# EAGLE design LME49830_Breakout (EAGLE 6.5.0)
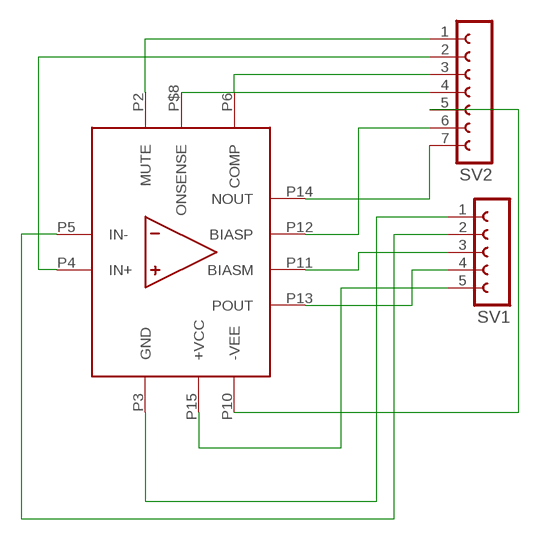
[diagram p0: schematic, sheet 1]

## Parts
SV1  FE05-1  [FE05-1]
SV2  FE07-1  [FE07]
U$1  LME49830  [NDN0015A]

## Nets
N$1: SV1.1 U$1.P3(GND)
N$2: SV1.2 U$1.P5(IN-)
N$3: SV1.3 U$1.P11(BIASM)
N$4: SV1.4 U$1.P13(POUT)
N$5: SV1.5 U$1.P15(+VCC)
N$6: SV2.1 U$1.P2(MUTE)
N$7: SV2.2 U$1.P4(IN+)
N$8: SV2.3 U$1.P6(COMP)
N$9: SV2.4 U$1.P$8(ONSENSE)
N$10: SV2.5 U$1.P10(-VEE)
N$11: SV2.6 U$1.P12(BIASP)
N$12: SV2.7 U$1.P14(NOUT)

## Library data of the parts
SV1 = con-lsta:FE05-1: FEMALE HEADER; OC_FARNELL: unknown; OC_NEWARK: unknown
SV2 = con-lsta:FE07-1: FEMALE HEADER; OC_FARNELL: unknown; OC_NEWARK: unknown
U$1 = LME49830:LME49830: Mono High Fidelity 200 Volt MOSFET Power Amplifier Input Stage with Mute Datasheet: http://www.ti.com/lit/ds/symlink/lme49830.pdf

## Board
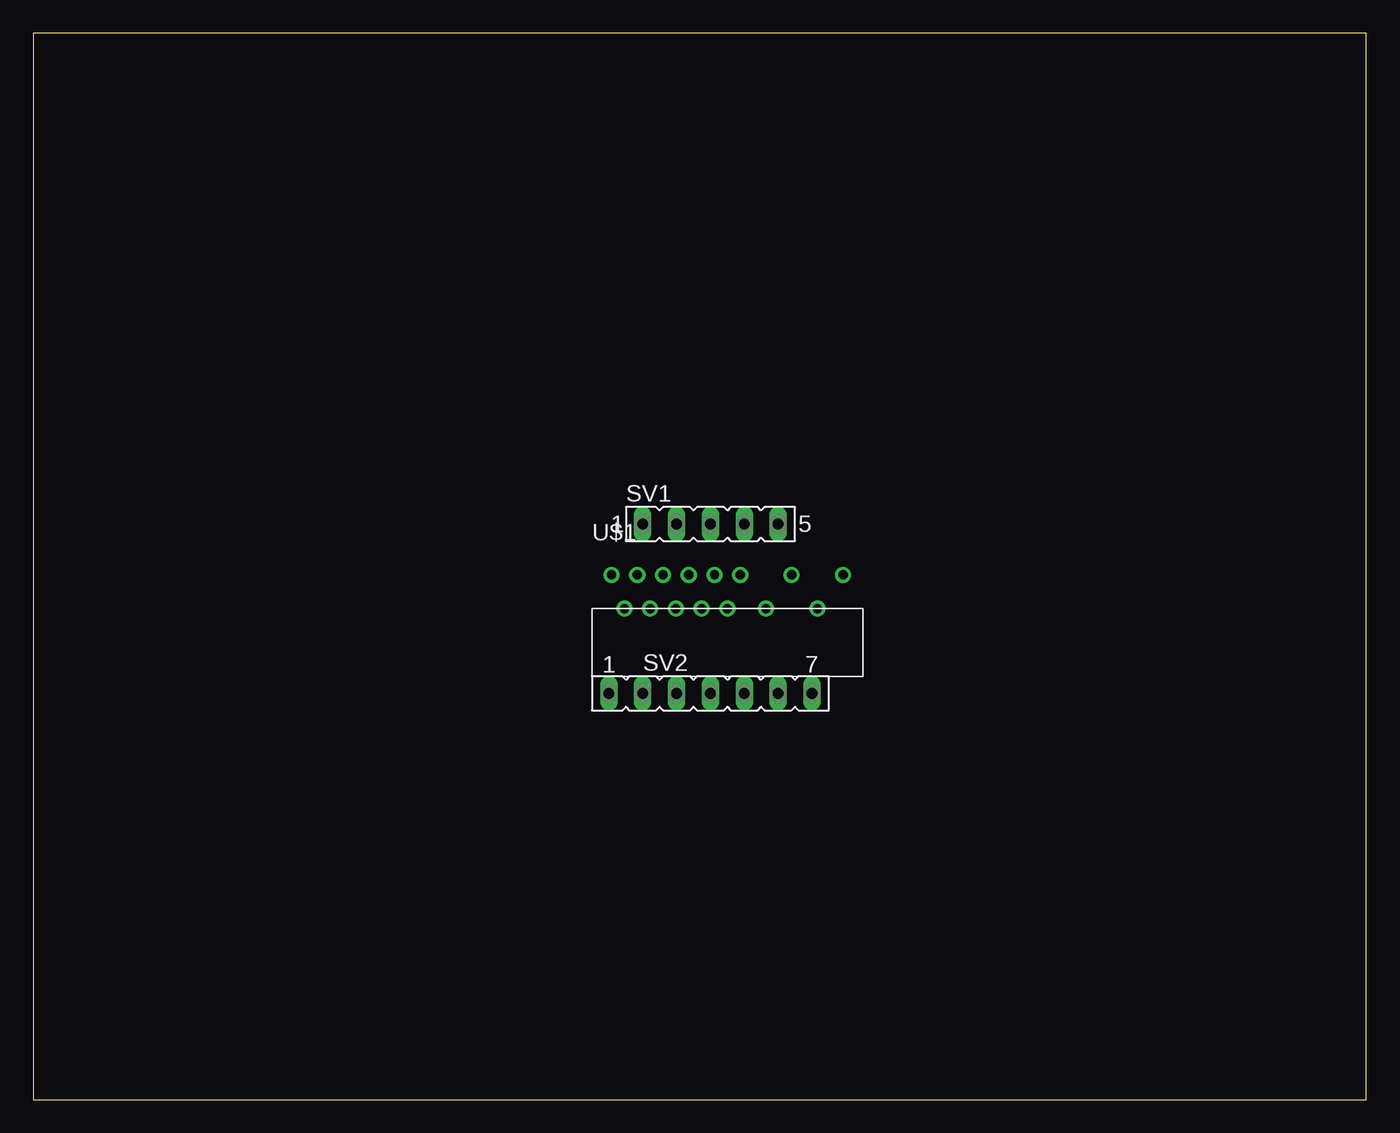
[diagram p1: board, top side]
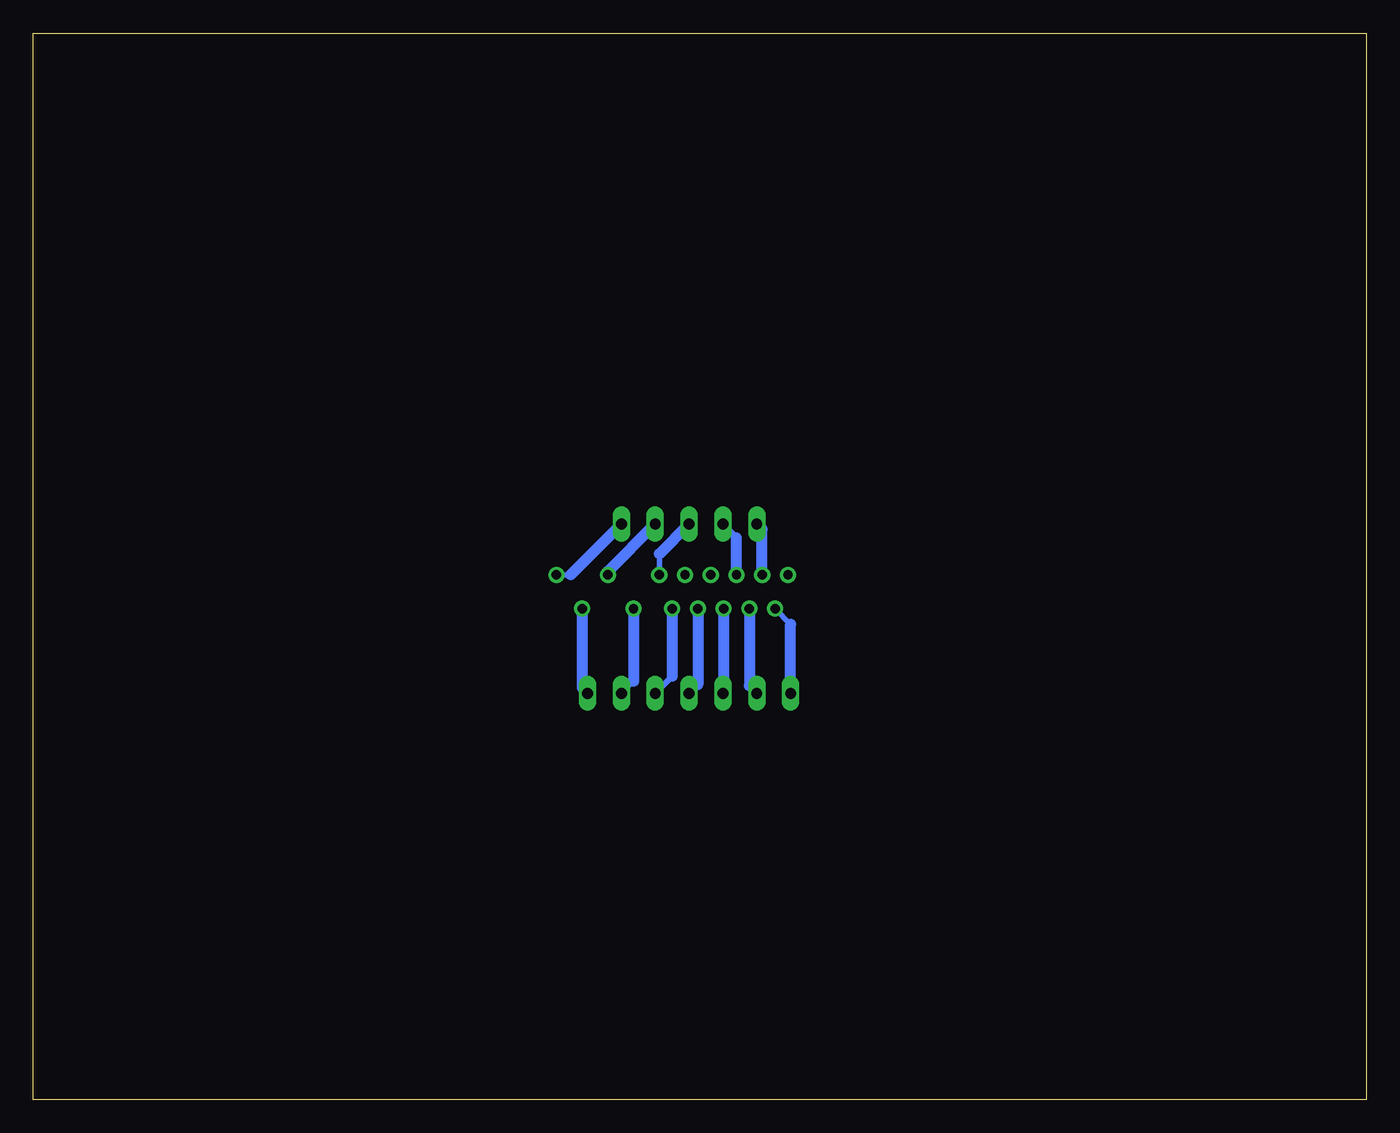
[diagram p2: board, bottom side, seen from below]

Size 100 x 80 mm. Coordinates in mm from the lower left corner, seen from the top.
Outline: 0,0 100,0 100,80 0,80 0,0
Copper layers (1*16): Top 0.035mm / dielectric 1.5mm / Bottom 0.035mm
Design rules "default": minimum track width 10mil, minimum drill 24mil, track to track 8mil, track to pad 8mil, pad to pad 8mil, via to via 8mil, smd to smd 8mil, copper to edge 40mil, drill to drill 8mil, minimum pad ring 10mil, minimum via ring 8mil, stop-mask expansion 4mil, vias tented up to drill 0mil, thermal gap 10mil

### Footprints (pad centres in the part's own frame; a part is rotated, then mirrored left to right if it is on the bottom)
FE05-1 = drill 0.813 long: 1 -5.08,0; 2 -2.54,0; 3 0,0; 4 2.54,0; 5 5.08,0
FE07 = drill 0.813 long: 1 -7.62,0; 2 -5.08,0; 3 -2.54,0; 4 0,0; 5 2.54,0; 6 5.08,0; 7 7.62,0
NDN0015A = drill 0.7: P1 -8.685,2.54; P2 -7.72,0; P3 -6.755,2.54; P4 -5.79,0; P5 -4.825,2.54; P6 -3.86,0; P7 -2.895,2.54; P9 -0.965,2.54; P10 0,0; P11 0.965,2.54; P12 2.895,0; P13 4.825,2.54; P14 6.755,0; P15 8.685,2.54; P$8 -1.93,0

### Placement (x,y rotation side)
SV1  50.8,43.18 0 top
SV2  50.8,30.48 0 top
U$1  52.07,36.83 0 top

### Tracks (layer width: path | path; a pad name or v marks a point on that pad's centre or on a via)
N$1
  Bottom 0.406: 45.31,42.77 SV1.1
  Bottom 0.813: U$1.P3 45.31,42.77
N$2
  Bottom 0.406: 47.24,42.16 SV1.2
  Bottom 0.813: U$1.P5 47.24,42.16
N$3
  Bottom 0.406: U$1.P11 53.03,40.95
  Bottom 0.813: 53.03,40.95 SV1.3
N$4
  Bottom 0.406: U$1.P13 56.9,39.62
  Bottom 0.813: 56.9,39.62 SV1.4
N$5
  Bottom 0.406: U$1.P15 59.69,39.37
  Bottom 0.813: 59.69,39.37 SV1.5
N$6
  Bottom 0.406: 43.18,35.66 U$1.P2
  Bottom 0.813: SV2.1 43.18,35.66
N$7
  Bottom 0.406: 46.28,31.04 SV2.2
  Bottom 0.813: U$1.P4 46.28,31.04
N$8
  Bottom 0.406: 48.21,30.53 SV2.3
  Bottom 0.813: U$1.P6 48.21,30.53
N$9
  Bottom 0.406: 50.14,31.14 SV2.4
  Bottom 0.813: U$1.P$8 50.14,31.14
N$10
  Bottom 0.406: 52.07,31.75 SV2.5
  Bottom 0.813: U$1.P10 52.07,31.75
N$11
  Bottom 0.406: 54.97,31.39 SV2.6
  Bottom 0.813: U$1.P12 54.97,31.39
N$12
  Bottom 0.406: 58.83,30.89 SV2.7
  Bottom 0.813: U$1.P14 58.83,30.89